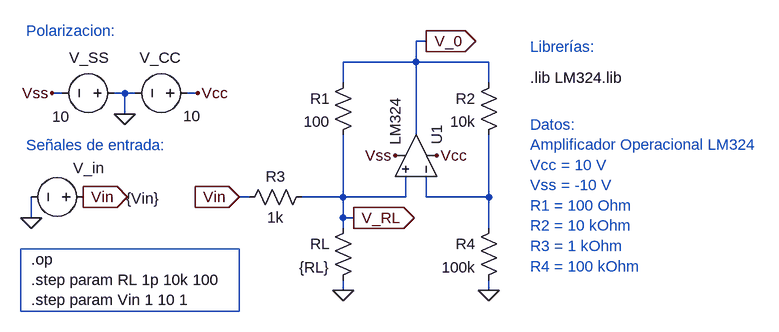
[diagram p0: schematic Lab_1_Circ_2_RL.asc]
Lab_1_Circ_2_RL.asc, the LTspice schematic file:
Version 4
SHEET 1 1560 680
WIRE 256 -240 240 -240
WIRE 240 -208 240 -240
WIRE 240 -208 128 -208
WIRE 352 -208 240 -208
WIRE 128 -176 128 -208
WIRE 352 -176 352 -208
WIRE -304 -160 -320 -160
WIRE -208 -160 -224 -160
WIRE -192 -160 -208 -160
WIRE -96 -160 -112 -160
WIRE -208 -128 -208 -160
WIRE 240 -96 240 -208
WIRE -16 0 -32 0
WIRE 128 0 128 -96
WIRE 128 0 64 0
WIRE 224 0 224 -32
WIRE 224 0 128 0
WIRE 256 0 256 -32
WIRE 352 0 352 -96
WIRE 352 0 256 0
WIRE -352 32 -352 0
WIRE 128 32 128 0
WIRE 144 32 128 32
WIRE 128 48 128 32
WIRE 352 48 352 0
WIRE 128 144 128 128
WIRE 352 144 352 128
FLAG 128 144 0
FLAG -96 -160 Vcc
FLAG 272 -64 Vcc
FLAG -320 -160 Vss
FLAG 208 -64 Vss
FLAG -208 -128 0
FLAG -352 32 0
FLAG 256 -240 V_0
IOPIN 256 -240 Out
FLAG -32 0 Vin
IOPIN -32 0 In
FLAG -272 0 Vin
IOPIN -272 0 Out
FLAG 352 144 0
FLAG 144 32 V_RL
IOPIN 144 32 Out
SYMBOL OpAmps\\opamp2 304 -64 M270
SYMATTR InstName U1
SYMATTR Value LM324
SYMBOL res 144 -192 M0
SYMATTR InstName R1
SYMATTR Value 100
SYMBOL res 368 -192 M0
SYMATTR InstName R2
SYMATTR Value 10k
SYMBOL res 80 -16 R90
WINDOW 0 0 56 VBottom 2
WINDOW 3 32 56 VTop 2
SYMATTR InstName R3
SYMATTR Value 1k
SYMBOL res 368 32 M0
SYMATTR InstName R4
SYMATTR Value 100k
SYMBOL res 144 32 M0
SYMATTR InstName RL
SYMATTR Value {RL}
SYMBOL voltage -256 0 M270
WINDOW 0 45 31 VLeft 2
WINDOW 3 -2 -50 VLeft 2
WINDOW 123 0 0 Left 0
WINDOW 39 0 0 Left 0
SYMATTR InstName V_in
SYMATTR Value {Vin}
SYMBOL voltage -96 -160 R90
WINDOW 0 -55 25 VRight 2
WINDOW 3 35 -5 VRight 2
WINDOW 123 0 0 Left 0
WINDOW 39 0 0 Left 0
SYMATTR InstName V_CC
SYMATTR Value 10
SYMBOL voltage -208 -160 R90
WINDOW 0 -55 25 VRight 2
WINDOW 3 36 85 VRight 2
WINDOW 123 0 0 Left 0
WINDOW 39 0 0 Left 0
SYMATTR InstName V_SS
SYMATTR Value 10
TEXT -360 -256 Left 2 ;Polarizacion:
TEXT -360 -80 Left 2 ;Señales de entrada:
TEXT -352 96 Left 2 !.op\n.step param RL 1p 10k 100\n.step param Vin 1 10 1
TEXT 416 -184 Left 2 !.lib LM324.lib
TEXT 416 -232 Left 2 ;Librerías:
TEXT 416 -112 Left 2 ;Datos:\nAmplificador Operacional LM324\nVcc = 10 V\nVss = -10 V\nR1 = 100 Ohm\nR2 = 10 kOhm\nR3 = 1 kOhm\nR4 = 100 kOhm
RECTANGLE Normal -32 176 -368 80

The netlist it stands for:
* Lab_1_Circ_2_RL.asc
XU1 V_RL N001 Vcc Vss V_0 LM324  ; pins In+ In- V+ V- OUT
R1 V_0 V_RL 100
R2 V_0 N001 10k
R3 V_RL Vin 1k
R4 N001 0 100k
RL V_RL 0 {RL}
V_in Vin 0 {Vin}
V_CC Vcc 0 10
V_SS 0 Vss 10
* Polarizacion:
* Señales de entrada:
.op
.step param RL 1p 10k 100
.step param Vin 1 10 1
.lib LM324.lib
* Librerías:
* Datos:
* Amplificador Operacional LM324
* Vcc = 10 V
* Vss = -10 V
* R1 = 100 Ohm
* R2 = 10 kOhm
* R3 = 1 kOhm
* R4 = 100 kOhm
.backanno
.end